# EAGLE schematic Schematic_withShiftResister (EAGLE 8.4.0)
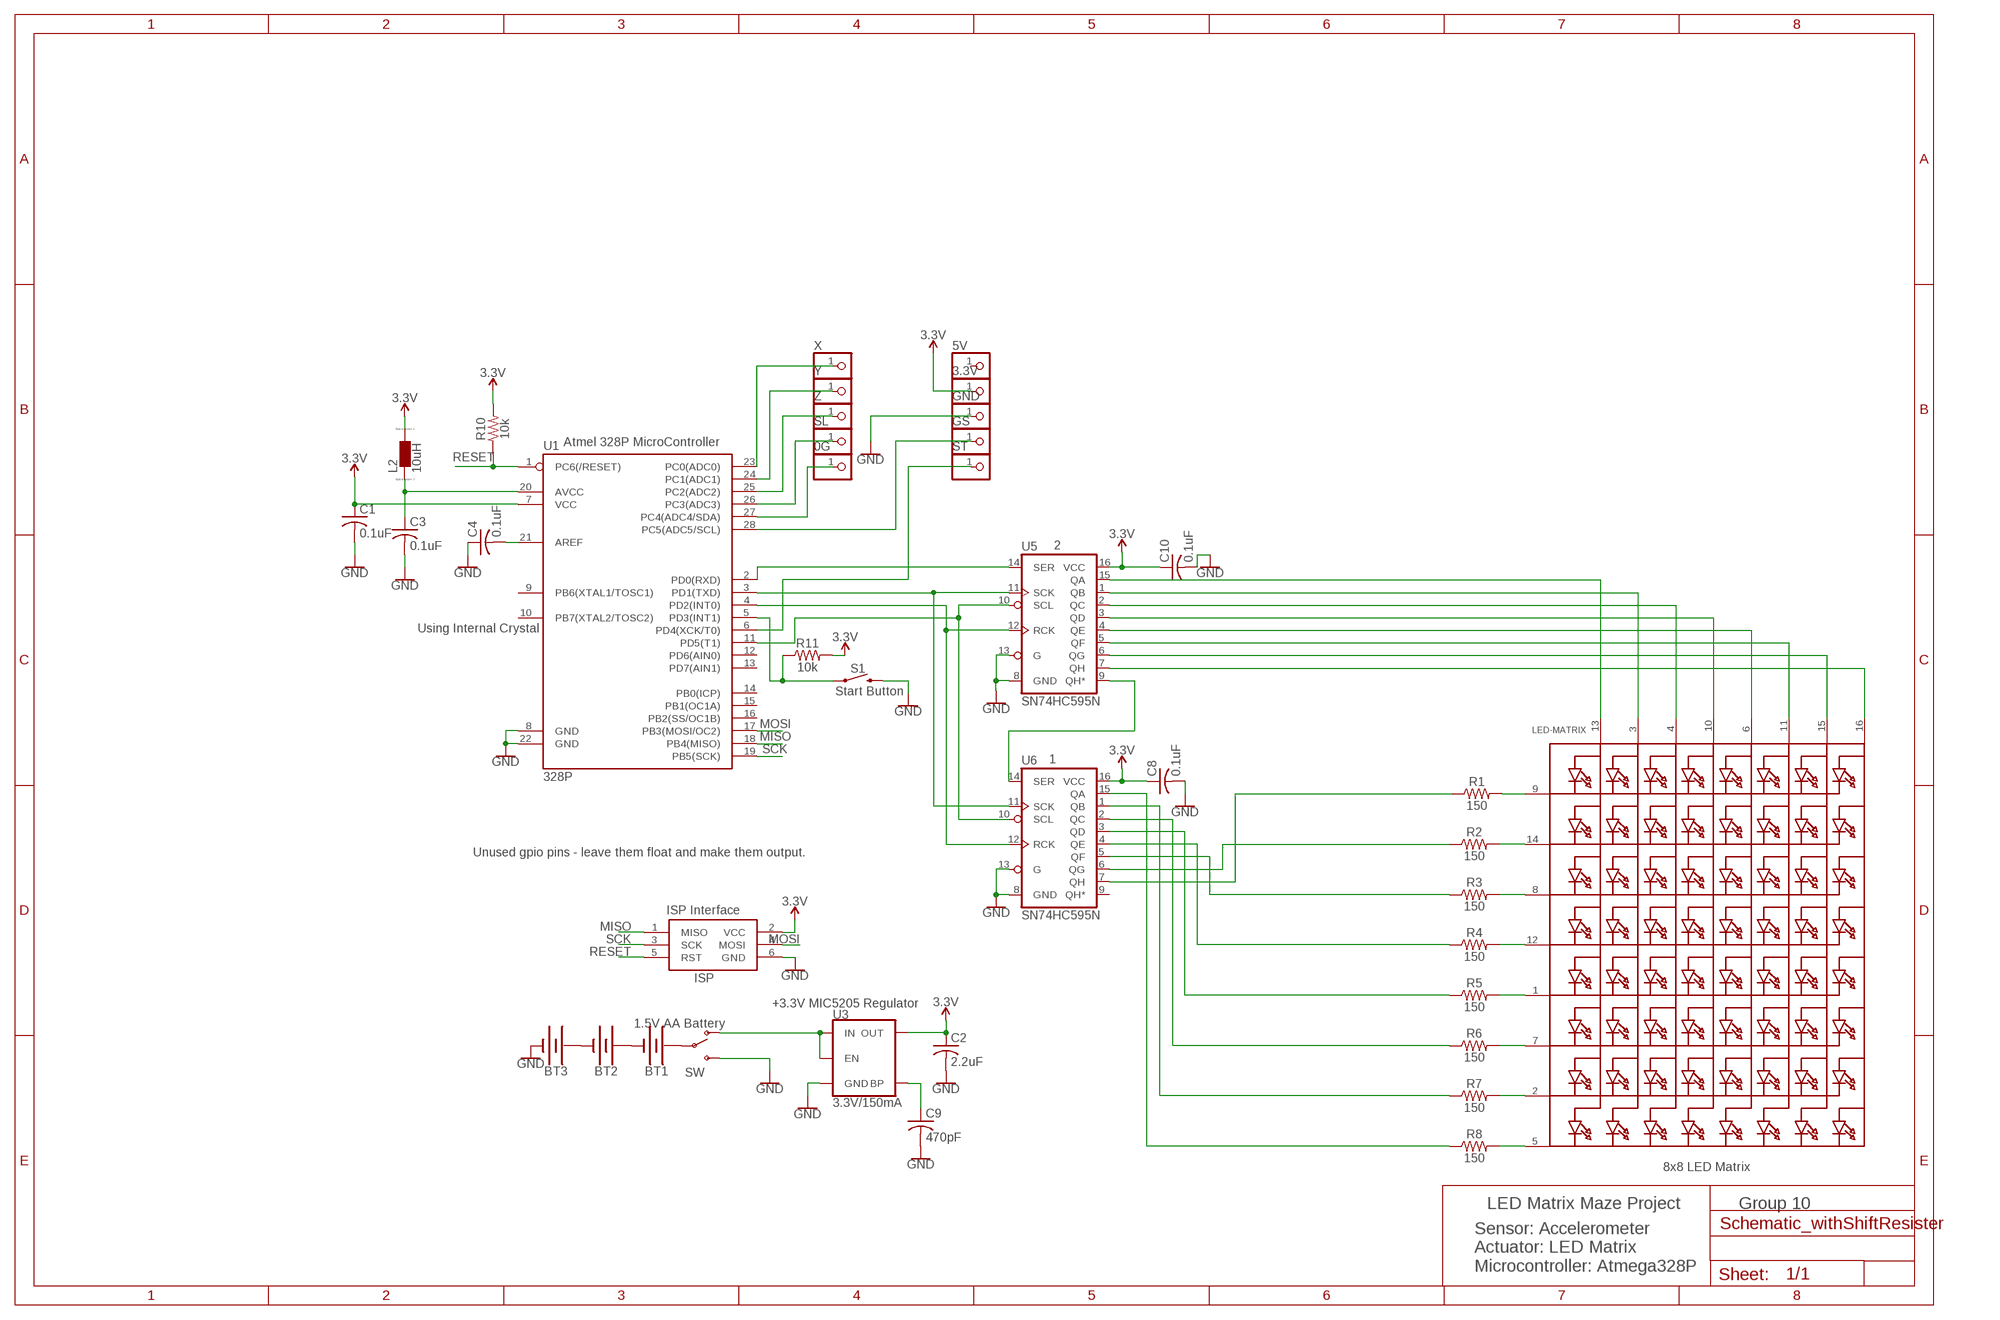
[diagram p0: schematic, sheet 1]

## Parts
0G  PINHD-1X1  [1X01]
3.3V  PINHD-1X1  [1X01]
5V  PINHD-1X1  [1X01]
BT1  BATTERY-AAA_KIT  [BATTERY-AAA-KIT]
BT2  BATTERY-AAA_KIT  [BATTERY-AAA-KIT]
BT3  BATTERY-AAA_KIT  [BATTERY-AAA-KIT]
C1  0.1uF  C-USC0805  [C0805]
C2  2.2uF  C-USC0805  [C0805]
C3  0.1uF  C-USC0805  [C0805]
C4  0.1uF  C-USC0805  [C0805]
C8  0.1uF  C-USC0805  [C0805]
C9  470pF  C-USC0805  [C0805]
C10  0.1uF  C-USC0805  [C0805]
GND  PINHD-1X1  [1X01]
GS  PINHD-1X1  [1X01]
ISP  AVRISP-6  [AVRISP]
L2  10uH  L  [L1812]
LED-MATRIX  SEGMENT_8X8_ROWCATHODEM12A881UR  [SEGMENT_BL-M12A881UR]
R1  150  150OHM-0603-1/10W-1%  [0603]
R2  150  150OHM-0603-1/10W-1%  [0603]
R3  150  150OHM-0603-1/10W-1%  [0603]
R4  150  150OHM-0603-1/10W-1%  [0603]
R5  150  150OHM-0603-1/10W-1%  [0603]
R6  150  150OHM-0603-1/10W-1%  [0603]
R7  150  150OHM-0603-1/10W-1%  [0603]
R8  150  150OHM-0603-1/10W-1%  [0603]
R10  10k  10KOHM-0603-1/10W-1%  [0603]
R11  10k  10KOHM-0603-1/10W-1%  [0603]
S1  MOMENTARY-SWITCH-SPST-PTH-6.0MM  [TACTILE_SWITCH_PTH_6.0MM]
SL  PINHD-1X1  [1X01]
ST  PINHD-1X1  [1X01]
SW  SWITCH-SPSTPTH_LOCK  [SWITCH-SPDT_LOCK.007S]
U1  328P  ATMEGA328P_PDIP  [DIP28]
U3  3.3V/150mA  V_REG_MIC52053.3V  [SOT23-5]
U5  SN74HC595N  74HC595N  [DIP16]
U6  SN74HC595N  74HC595N  [DIP16]
X  PINHD-1X1  [1X01]
Y  PINHD-1X1  [1X01]
Z  PINHD-1X1  [1X01]

## Nets
3.3V: 3.3V.1 C1.1 C2.1 C8.1 C10.1 ISP.2(VCC) L2.1 R10.2 R11.2 U1.7(VCC) U3.5(OUT) U5.16(VCC) U6.16(VCC)
GND: BT3.GND@1(-) C1.2 C2.2 C3.2 C4.1 C8.2 C9.2 C10.2 GND.1 ISP.6(GND) S1.3 SW.3(S) U1.8(GND) U1.22(GND) U3.2(GND) U5.8(GND) U5.13(G) U6.8(GND) U6.13(G)
MISO: ISP.1(MISO) U1.18(PB4(MISO))
MOSI: ISP.4(MOSI) U1.17(PB3(MOSI/OC2))
N$1: LED-MATRIX.9(K1) R1.2
N$2: LED-MATRIX.14(K2) R2.2
N$3: LED-MATRIX.8(K3) R3.2
N$4: LED-MATRIX.12(K4) R4.2
N$5: LED-MATRIX.1(K5) R5.2
N$6: LED-MATRIX.7(K6) R6.2
N$7: LED-MATRIX.2(K7) R7.2
N$8: LED-MATRIX.5(K8) R8.2
N$9: LED-MATRIX.13(A1) U5.15(QA)
N$10: LED-MATRIX.4(A3) U5.2(QC)
N$11: LED-MATRIX.10(A4) U5.3(QD)
N$12: LED-MATRIX.6(A5) U5.4(QE)
N$13: LED-MATRIX.11(A6) U5.5(QF)
N$14: LED-MATRIX.15(A7) U5.6(QG)
N$15: LED-MATRIX.16(A8) U5.7(QH)
N$16: R8.1 U6.15(QA)
N$17: U1.23(PC0(ADC0)) X.1
N$18: U1.24(PC1(ADC1)) Y.1
N$19: U1.25(PC2(ADC2)) Z.1
N$20: R7.1 U6.1(QB)
N$21: R6.1 U6.2(QC)
N$22: R5.1 U6.3(QD)
N$23: R4.1 U6.4(QE)
N$24: R3.1 U6.5(QF)
N$25: R2.1 U6.6(QG)
N$26: R1.1 U6.7(QH)
N$27: LED-MATRIX.3(A2) U5.1(QB)
N$28: U1.3(PD1(TXD)) U5.11(SCK) U6.11(SCK)
N$29: SW.1(O) U3.1(IN) U3.3(EN)
N$30: BT2.GND@1(-) BT3.PWR@1(+)
N$31: BT1.GND@1(-) BT2.PWR@1(+)
N$32: C9.1 U3.4(BP)
N$33: U1.2(PD0(RXD)) U5.14(SER)
N$34: U5.9(QH*) U6.14(SER)
N$35: U1.4(PD2(INT0)) U5.12(RCK) U6.12(RCK)
N$36: BT1.PWR@1(+) SW.2(P)
N$37: C4.2 U1.21(AREF)
N$38: U1.11(PD5(T1)) U5.10(SCL) U6.10(SCL)
N$40: R11.1 S1.1 U1.5(PD3(INT1))
N$41: SL.1 U1.26(PC3(ADC3))
N$42: 0G.1 U1.27(PC4(ADC4/SDA))
N$43: C3.1 L2.2 U1.20(AVCC)
N$45: GS.1 U1.28(PC5(ADC5/SCL))
N$46: ST.1 U1.6(PD4(XCK/T0))
RESET: ISP.5(RST) R10.1 U1.1(PC6(/RESET))
SCK: ISP.3(SCK) U1.19(PB5(SCK))
Unconnected: 5V.1 U1.9(PB6(XTAL1/TOSC1)) U1.10(PB7(XTAL2/TOSC2)) U1.12(PD6(AIN0)) U1.13(PD7(AIN1)) U1.14(PB0(ICP)) U1.15(PB1(OC1A)) U1.16(PB2(SS/OC1B)) U6.9(QH*)

## Notes on the sheet
- Atmel 328P MicroController
- 2
- Using Internal Crystal
- Start Button
- 1
- Unused gpio pins - leave them float and make them output.
- ISP Interface
- +3.3V MIC5205 Regulator
- 1.5V AA Battery
- 8x8 LED Matrix
- LED Matrix Maze Project | Group 10
- Sensor: Accelerometer
  Actuator: LED Matrix
  Microcontroller: Atmega328P

## Library data of the parts
0G 3.3V 5V GND GS SL ST X Y Z = adafruit:PINHD-1X1: Pin header 1x1 for 0.1" spacing With round pins
BT1-BT3 = SparkFun-Batteries:BATTERY: Battery - Single Cell A variety of battery chemistries, sizes, and footprints. Device List: 20MM_PTH - Coin Cell Battery Holder - 20mm (PTH) <https://www.sparkfun.com/products/783> 6.8MM_PTH - Coin Cell Battery Holder - 6.8MM(SMD) <https://www.digikey.com/product-detail/en/seiko-instruments/MS621FE-FL11E/728-1057-ND/1889208?WT.srch=1&gclid=CNOQ5a6LzdQCFZS2wAodXCkE0g> 12MM_SMD - Coin Cell Battery Holder - 12mm (SMD) <https://www.sparkfun.com/products/10592> 12MM_PTH - Coin Cell Battery Holder - 12mm (PTH) <https://www.sparkfun.com/products/7948> 20MM_SMD - 20mm Coin Cell Battery Holder (SMD) (2 legs) Used on the Big Time Watch Kit <https://www.sparkfun.com/products/11734> 20MM_SMD_4LEGS - Coin Cell Battery Holder - 20mm (SMD) <https://www.sparkfun.com/products/11892> 20MM_SMD_4LEGS_OVERPASTE - Coin Cell Battery Holder - 20mm (SMD) <https://www.sparkfun.com/products/11892> (Over-paste on the legs) 24.5MM_PTH - Coin Cell Battery Holder - 24.5mm (PTH) <https://www.sparkfun.com/products/8863> 9V - 9V Battery Holder - PC Mount Used on the SparkFun SparkPunk Sound Kit <https://www.sparkfun.com/products/11177> and SparkFun SparkPunk Sequencer Kit <https://www.sparkfun.com/products/12707> 18650 - Battery Holder - 18650 (PTH) <https://www.sparkfun.com/products/13113> AA - Battery Holder - 1xAA (PTH) <https://www.sparkfun.com/products/7949> AAA - Battery Holder - 1xAAA (PTH) <https://www.sparkfun.com/products/12718> AA_KIT - Battery Holder - 1xAA (PTH) <https://www.sparkfun.com/products/7949> Special kit package - pads only have exposed copper on one side of the board. AAA_KIT - Battery Holder - 1xAAA (PTH) <https://www.sparkfun.com/products/12718> Special kit package - pads only have exposed copper on one side of the board.; PROD_ID: BATT-08571; SF_SKU: PRT-12718
C1-C4 C8-C10 = adafruit:C-US: CAPACITOR, American symbol
ISP = adafruit:AVRISP: AVR ISP HEADER Standard 6 pin header for AVR programming; OC_NEWARK: unknown
L2 = eagle-ltspice:L: INDUCTOR, European symbol; OC_NEWARK: unknown; SPICEMODEL: NONE; SPICEPREFIX: L
LED-MATRIX = adafruit:SEGMENT_8X8_ROWCATHODE: 8x8 LED Segment Displays: Row = Cathode 0.7" Red 8X8 Matrix, 1.9mm Round LEDs - BL-M07C881UR 1.2" Red 8x8 Matrix, 3.0mm Round LEDs - BL-M12A881UR 1.2" Red 8x8 Matrix, 3.0mm Square LEDs - BL-M12A883; OC_NEWARK: unknown
R1-R8 = SparkFun-Resistors:150OHM: 150Ω resistor A resistor is a passive two-terminal electrical component that implements electrical resistance as a circuit element. Resistors act to reduce current flow, and, at the same time, act to lower voltage levels within circuits. - Wikipedia; PROD_ID: RES-11028
R10 R11 = SparkFun-Resistors:10KOHM: 10kΩ resistor A resistor is a passive two-terminal electrical component that implements electrical resistance as a circuit element. Resistors act to reduce current flow, and, at the same time, act to lower voltage levels within circuits. - Wikipedia; PROD_ID: RES-00824
S1 = SparkFun-Switches:MOMENTARY-SWITCH-SPST: Momentary Switch (Pushbutton) - SPST Normally-open (NO) SPST momentary switches (buttons, pushbuttons). Variants PTH-12MM - 12mm square, through-hole Momentary Pushbutton Switch - 12mm Square <https://www.sparkfun.com/products/9190> (COM-09190) PTH-6.0MM, PTH-6.0MM-KIT - 6.0mm square, through-hole Mini Pushbutton Switch <https://www.sparkfun.com/products/97> (COM-00097) KIT package intended for soldering kit's - only one side of pads' copper is exposed. PTH-RIGHT-ANGLE-KIT - Right-angle, through-hole Right Angle Tactile Button <https://www.sparkfun.com/products/10791> - Used on SparkFun BigTime Watch Kit <https://www.sparkfun.com/products/11734> SMD-12MM - 12mm square, surface-mount Tactile Button - SMD (12mm) <https://www.sparkfun.com/products/12993> (COM-12993) Used on SparkFun PicoBoard <https://www.sparkfun.com/products/11888> SMD-4.5MM - 4.5mm Square Trackball Switch Used on SparkFun Blackberry Trackballer Breakout <https://www.sparkfun.com/products/13169> SMD-4.6MMX2.8MM - 4.60mm x 2.80mm, surface mount Used on SparkFun SAMD21 Mini Breakout <https://www.sparkfun.com/products/13664> SMD-5.2MM, SMD-5.2-REDUNDANT - 5.2mm square, surface-mount Mini Pushbutton Switch - SMD <https://www.sparkfun.com/products/8720> (COM-08720) Used on Arduino Pro Mini <https://www.sparkfun.com/products/11114> REDUNDANT package connects both switch circuits together SMD-6.0X3.5MM - 6.0 x 3.5mm, surface mount Momentary Reset Switch SMD <https://www.sparkfun.com/products/8229> (COM-08229) SMD-6.2MM-TALL - 6.2mm square, surface mount Tactile Button - SMD (6mm) <https://www.sparkfun.com/products/12992> Used on SparkFun Digital Sandbox <https://www.sparkfun.com/products/12651> SMD-RIGHT-ANGLE - Right-angle, surface mount Used on SparkFun Block for Intel® Edison - Arduino <https://www.sparkfun.com/products/13036>; OC_NEWARK: unknown; PROD_ID: SWCH-08441; SF_SKU: COM-00097
SW = SparkFun:SWITCH-SPST: SPST Switch Simple slide switch. Spark Fun Electronics SKU : COM-00102; OC_NEWARK: unknown
U1 = SparkFun-IC-Microcontroller:ATMEGA328P_PDIP: Atmel 328P Through hole ATMEGA328P uC used in the Arduino 32kb flash, 1k EEPROM, 2k SRAM Datasheet <http://www.sparkfun.com/datasheets/Components/SMD/ATMega328.pdf> SparkFun Products Storefront component: AVR 28 Pin 20MHz 32K 6A/D - ATMega328P <https://www.sparkfun.com/products/9061> (COM-09061) SparkFun Simon Says - Through-Hole Soldering Kit <https://www.sparkfun.com/products/10547> (KIT-10547) SparkFun Learn to Solder - Simon Says <https://www.sparkfun.com/products/13708> (KIT-13708) SparkFun BigTime Watch Kit <https://www.sparkfun.com/products/11734> (KIT-11734) SparkFun ClockIt <https://www.sparkfun.com/products/10930> (KIT-10930) SparkFun Serial Enabled LCD Kit <https://www.sparkfun.com/products/10097> (LCD-10097) SparkFun Simon Tilts - Through Hole Soldering Kit <https://www.sparkfun.com/products/12634> (KIT-12634) SparkFun Frequency Counter Kit <https://www.sparkfun.com/products/10140> (KIT-10140) FabFM Radio Kit <https://www.sparkfun.com/products/11043> (KIT-11043) SparkFun Binary Blaster Kit <https://www.sparkfun.com/products/12037> (KIT-12037) SparkFun Metro-Gnome <https://www.sparkfun.com/products/9236> (KIT-09236) ATmega328 with Arduino Optiboot (Uno) <https://www.sparkfun.com/products/10524> (DEV-10524); OC_NEWARK: unknown; PROD_ID: IC-09136
U3 = SparkFun-IC-Power:V_REG_MIC5205: V_REG MIC5205 Standard 3.3V, 5V, and Adjustable 150mA LDO voltage regulator in SOT-23 layout. Micrel part MIC5205. BP (by-pass) pin is used to lower output noise with 470pF cap, may be left open. On the adjustable version BP is used to set output.; OC_NEWARK: unknown; PROD_ID: VREG-00822
U5 U6 = SparkFun-IC-Logic:74*595: 8-Bit Shift Register (Serial to Parallel) Datasheet <http://cdn.sparkfun.com/datasheets/BreakoutBoards/MM74HC595.pdf> SparkFun Products SparkFun Shift Register Breakout - 74HC595 <https://www.sparkfun.com/products/10680> (BOB-10680); PROD_ID: IC-13123

## Net classes
0 default: width 0.254 mm, drill 0.508 mm, clearance 0.254 mm